# Altium schematic sheet JTAG.SchDoc
size A
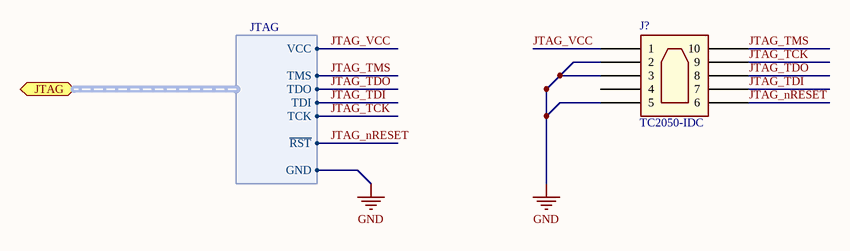
[diagram p0: JTAG.SchDoc]

## Parts
J?  TC2050-IDC  [TC2050-IDC]

## Ports
JTAG (harness JTAG)

## Harnesses
JTAG: TCK, TDI, TDO, TMS, VCC, GND, ~{RST}

## Nets
GND: J?.2 J?.3 J?.5 ; port JTAG.GND
JTAG_nRESET: J?.6 ; port JTAG.~{RST}
JTAG_TCK: J?.9 ; port JTAG.TCK
JTAG_TDI: J?.7 ; port JTAG.TDI
JTAG_TDO: J?.8 ; port JTAG.TDO
JTAG_TMS: J?.10 ; port JTAG.TMS
JTAG_VCC: J?.1 ; port JTAG.VCC

Not connected (* = marked no-connect by the designer): J? 4